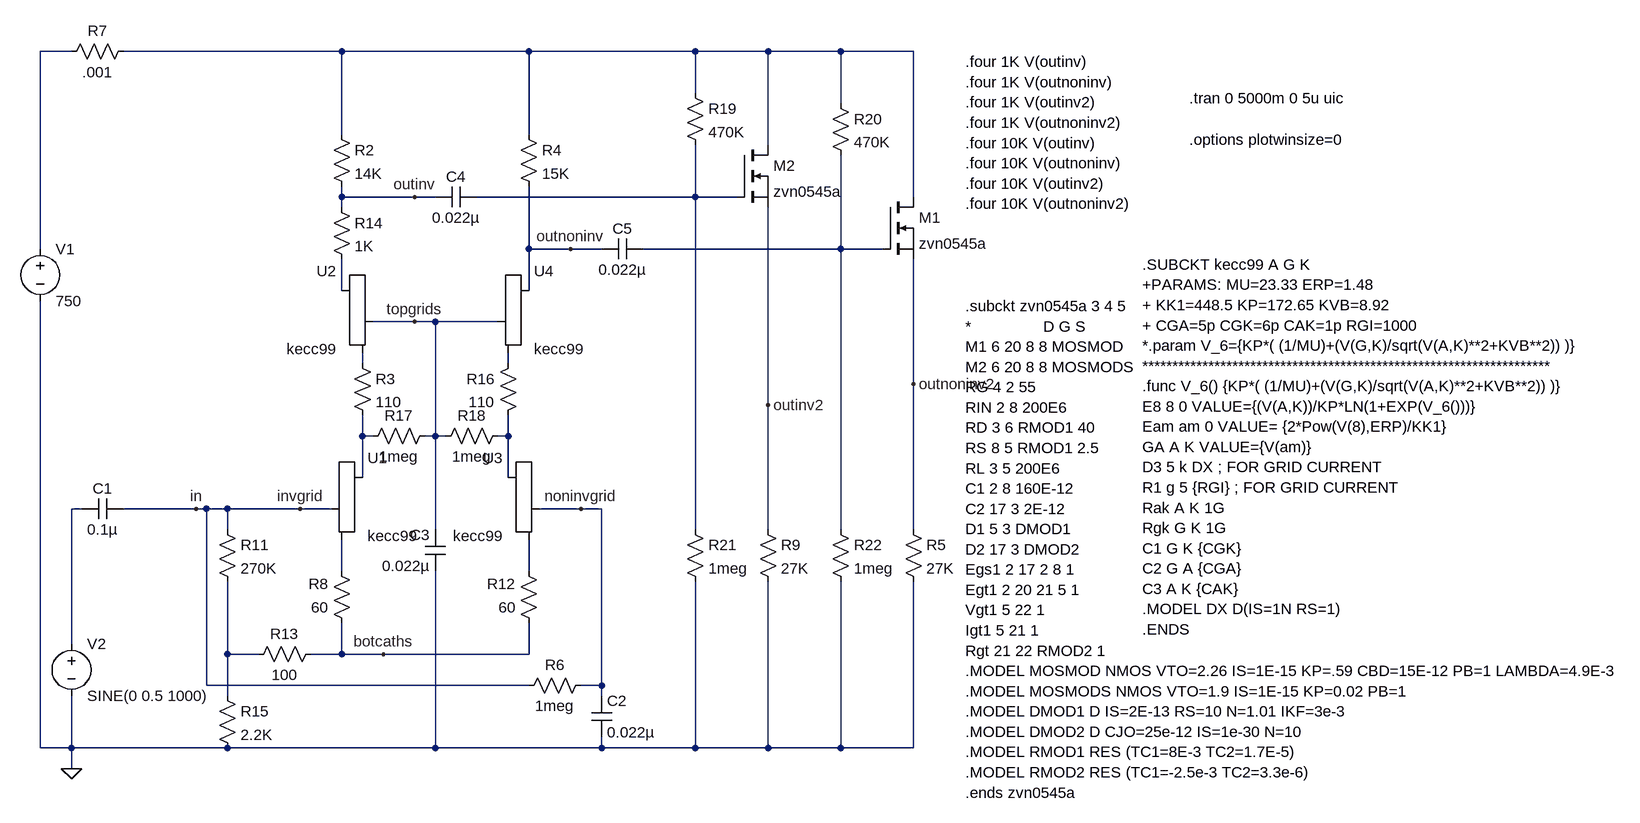
[diagram p0: schematic ltp_cascode_nmos_ecc99.asc]
ltp_cascode_nmos_ecc99.asc, the LTspice schematic file:
Version 4
SHEET 1 2892 944
WIRE -336 -448 -384 -448
WIRE 80 -448 -256 -448
WIRE 368 -448 80 -448
WIRE 624 -448 368 -448
WIRE 736 -448 624 -448
WIRE 848 -448 736 -448
WIRE 960 -448 848 -448
WIRE 624 -384 624 -448
WIRE 848 -368 848 -448
WIRE 80 -320 80 -448
WIRE 368 -320 368 -448
WIRE 736 -304 736 -448
WIRE 80 -224 80 -240
WIRE 192 -224 80 -224
WIRE 224 -224 192 -224
WIRE 624 -224 624 -304
WIRE 624 -224 288 -224
WIRE 688 -224 624 -224
WIRE 960 -224 960 -448
WIRE 80 -208 80 -224
WIRE -384 -144 -384 -448
WIRE 368 -144 368 -240
WIRE 432 -144 368 -144
WIRE 480 -144 432 -144
WIRE 848 -144 848 -288
WIRE 848 -144 544 -144
WIRE 912 -144 848 -144
WIRE 80 -80 80 -128
WIRE 368 -80 368 -144
WIRE 192 -32 128 -32
WIRE 224 -32 192 -32
WIRE 320 -32 224 -32
WIRE 112 32 112 16
WIRE 336 32 336 16
WIRE 960 64 960 -128
WIRE 736 96 736 -208
WIRE 112 144 112 112
WIRE 128 144 112 144
WIRE 224 144 224 -32
WIRE 224 144 208 144
WIRE 240 144 224 144
WIRE 336 144 336 112
WIRE 336 144 320 144
WIRE 112 208 112 144
WIRE 336 208 336 144
WIRE -320 256 -336 256
WIRE -144 256 -256 256
WIRE -128 256 -144 256
WIRE -96 256 -128 256
WIRE 16 256 -96 256
WIRE 64 256 16 256
WIRE 448 256 384 256
WIRE 480 256 448 256
WIRE -96 288 -96 256
WIRE 224 288 224 144
WIRE 624 288 624 -224
WIRE 736 288 736 96
WIRE 848 288 848 -144
WIRE 960 288 960 64
WIRE 80 352 80 304
WIRE 368 352 368 304
WIRE -336 464 -336 256
WIRE -96 480 -96 368
WIRE -48 480 -96 480
WIRE 80 480 80 432
WIRE 80 480 32 480
WIRE 144 480 80 480
WIRE 368 480 368 432
WIRE 368 480 144 480
WIRE -128 528 -128 256
WIRE 368 528 -128 528
WIRE 480 528 480 256
WIRE 480 528 448 528
WIRE -96 544 -96 480
WIRE 480 544 480 528
WIRE -384 624 -384 -64
WIRE -336 624 -336 544
WIRE -336 624 -384 624
WIRE -96 624 -336 624
WIRE 224 624 224 352
WIRE 224 624 -96 624
WIRE 480 624 480 608
WIRE 480 624 224 624
WIRE 624 624 624 368
WIRE 624 624 480 624
WIRE 736 624 736 368
WIRE 736 624 624 624
WIRE 848 624 848 368
WIRE 848 624 736 624
WIRE 960 624 960 368
WIRE 960 624 848 624
WIRE -336 656 -336 624
FLAG -336 656 0
FLAG 192 -224 outinv
FLAG -144 256 in
FLAG 432 -144 outnoninv
FLAG 960 64 outnoninv2
FLAG 736 96 outinv2
FLAG 192 -32 topgrids
FLAG 448 256 noninvgrid
FLAG 16 256 invgrid
FLAG 144 480 botcaths
SYMBOL Misc\\triode 112 256 R0
SYMATTR InstName U1
SYMATTR Value kecc99
SYMBOL voltage -384 -160 R0
WINDOW 123 0 0 Left 0
WINDOW 39 0 0 Left 0
SYMATTR InstName V1
SYMATTR Value 750
SYMBOL voltage -336 448 R0
WINDOW 123 0 0 Left 0
WINDOW 39 0 0 Left 0
SYMATTR InstName V2
SYMATTR Value SINE(0 0.5 1000)
SYMBOL cap -256 240 R90
WINDOW 0 0 32 VBottom 0
WINDOW 3 32 32 VTop 0
SYMATTR InstName C1
SYMATTR Value 0.1µ
SYMBOL res 944 272 R0
SYMATTR InstName R5
SYMATTR Value 27K
SYMBOL Misc\\triode 336 256 M0
SYMATTR InstName U3
SYMATTR Value kecc99
SYMBOL res 720 272 R0
SYMATTR InstName R9
SYMATTR Value 27K
SYMBOL nmos 912 -224 R0
SYMATTR InstName M1
SYMATTR Value zvn0545a
SYMATTR Prefix X
SYMBOL nmos 688 -304 R0
SYMATTR InstName M2
SYMATTR Value zvn0545a
SYMATTR Prefix X
SYMBOL cap 464 544 R0
SYMATTR InstName C2
SYMATTR Value 0.022µ
SYMBOL Misc\\triode 80 -32 M0
SYMATTR InstName U2
SYMATTR Value kecc99
SYMBOL Misc\\triode 368 -32 R0
SYMATTR InstName U4
SYMATTR Value kecc99
SYMBOL res 64 -336 R0
SYMATTR InstName R2
SYMATTR Value 14K
SYMBOL res 352 -336 R0
SYMATTR InstName R4
SYMATTR Value 15K
SYMBOL res -240 -464 R90
WINDOW 0 0 56 VBottom 0
WINDOW 3 32 56 VTop 0
SYMATTR InstName R7
SYMATTR Value .001
SYMBOL cap 240 288 M0
SYMATTR InstName C3
SYMATTR Value 0.022µ
SYMBOL res -112 272 R0
SYMATTR InstName R11
SYMATTR Value 270K
SYMBOL res -112 528 R0
SYMATTR InstName R15
SYMATTR Value 2.2K
SYMBOL res 96 16 R0
SYMATTR InstName R3
SYMATTR Value 110
SYMBOL res 352 16 M0
SYMATTR InstName R16
SYMATTR Value 110
SYMBOL res 224 128 R90
WINDOW 0 0 56 VBottom 0
WINDOW 3 32 56 VTop 0
SYMATTR InstName R17
SYMATTR Value 1meg
SYMBOL res 336 128 R90
WINDOW 0 0 56 VBottom 0
WINDOW 3 32 56 VTop 0
SYMATTR InstName R18
SYMATTR Value 1meg
SYMBOL res 464 512 R90
WINDOW 0 0 56 VBottom 0
WINDOW 3 32 56 VTop 0
SYMATTR InstName R6
SYMATTR Value 1meg
SYMBOL res 96 448 R180
WINDOW 0 36 76 Left 0
WINDOW 3 36 40 Left 0
SYMATTR InstName R8
SYMATTR Value 60
SYMBOL res 384 448 R180
WINDOW 0 36 76 Left 0
WINDOW 3 36 40 Left 0
SYMATTR InstName R12
SYMATTR Value 60
SYMBOL res 48 464 R90
WINDOW 0 0 56 VBottom 0
WINDOW 3 32 56 VTop 0
SYMATTR InstName R13
SYMATTR Value 100
SYMBOL res 64 -224 R0
SYMATTR InstName R14
SYMATTR Value 1K
SYMBOL cap 288 -240 R90
WINDOW 0 0 32 VBottom 0
WINDOW 3 32 32 VTop 0
SYMATTR InstName C4
SYMATTR Value 0.022µ
SYMBOL cap 544 -160 R90
WINDOW 0 0 32 VBottom 0
WINDOW 3 32 32 VTop 0
SYMATTR InstName C5
SYMATTR Value 0.022µ
SYMBOL res 608 -400 R0
SYMATTR InstName R19
SYMATTR Value 470K
SYMBOL res 832 -384 R0
SYMATTR InstName R20
SYMATTR Value 470K
SYMBOL res 608 272 R0
SYMATTR InstName R21
SYMATTR Value 1meg
SYMBOL res 832 272 R0
SYMATTR InstName R22
SYMATTR Value 1meg
TEXT 1384 -376 Left 0 !.tran 0 5000m 0 5u uic
TEXT 1384 -312 Left 0 !.options plotwinsize=0
TEXT 1040 -432 Left 0 !.four 1K V(outinv)\n.four 1K V(outnoninv)\n.four 1K V(outinv2)\n.four 1K V(outnoninv2)\n.four 10K V(outinv)\n.four 10K V(outnoninv)\n.four 10K V(outinv2)\n.four 10K V(outnoninv2)
TEXT 1040 -56 Left 0 !.subckt zvn0545a 3 4 5\n*                D G S\nM1 6 20 8 8 MOSMOD\nM2 6 20 8 8 MOSMODS\nRG 4 2 55\nRIN 2 8 200E6\nRD 3 6 RMOD1 40\nRS 8 5 RMOD1 2.5 \nRL 3 5 200E6\nC1 2 8 160E-12\nC2 17 3 2E-12 \nD1 5 3 DMOD1\nD2 17 3 DMOD2\nEgs1 2 17 2 8 1\nEgt1 2 20 21 5 1\nVgt1 5 22 1\nIgt1 5 21 1\nRgt 21 22 RMOD2 1\n.MODEL MOSMOD NMOS VTO=2.26 IS=1E-15 KP=.59 CBD=15E-12 PB=1 LAMBDA=4.9E-3\n.MODEL MOSMODS NMOS VTO=1.9 IS=1E-15 KP=0.02 PB=1\n.MODEL DMOD1 D IS=2E-13 RS=10 N=1.01 IKF=3e-3\n.MODEL DMOD2 D CJO=25e-12 IS=1e-30 N=10\n.MODEL RMOD1 RES (TC1=8E-3 TC2=1.7E-5)\n.MODEL RMOD2 RES (TC1=-2.5e-3 TC2=3.3e-6)\n.ends zvn0545a
TEXT 1312 -120 Left 0 !.SUBCKT kecc99 A G K \n+PARAMS: MU=23.33 ERP=1.48\n+ KK1=448.5 KP=172.65 KVB=8.92\n+ CGA=5p CGK=6p CAK=1p RGI=1000\n*.param V_6={KP*( (1/MU)+(V(G,K)/sqrt(V(A,K)**2+KVB**2)) )} \n********************************************************************\n.func V_6() {KP*( (1/MU)+(V(G,K)/sqrt(V(A,K)**2+KVB**2)) )} \nE8 8 0 VALUE={(V(A,K))/KP*LN(1+EXP(V_6()))}\nEam am 0 VALUE= {2*Pow(V(8),ERP)/KK1}\nGA A K VALUE={V(am)}\nD3 5 k DX ; FOR GRID CURRENT\nR1 g 5 {RGI} ; FOR GRID CURRENT\nRak A K 1G\nRgk G K 1G\nC1 G K {CGK}\nC2 G A {CGA}\nC3 A K {CAK}\n.MODEL DX D(IS=1N RS=1)\n.ENDS

The netlist it stands for:
* ltp_cascode_nmos_ecc99.asc
XU1 N008 invgrid N011 kecc99
V1 N001 0 750
V2 N010 0 SINE(0 0.5 1000)
C1 invgrid N010 0.1µ
R5 outnoninv2 0 27K
XU3 N009 noninvgrid N012 kecc99
R9 outinv2 0 27K
XM1 N002 N004 outnoninv2 zvn0545a  ; pins D G S
XM2 N002 N003 outinv2 zvn0545a  ; pins D G S
C2 noninvgrid 0 0.022µ
XU2 N005 topgrids N006 kecc99
XU4 outnoninv topgrids N007 kecc99
R2 N002 outinv 14K
R4 N002 outnoninv 15K
R7 N002 N001 .001
C3 topgrids 0 0.022µ
R11 invgrid N013 270K
R15 N013 0 2.2K
R3 N006 N008 110
R16 N007 N009 110
R17 topgrids N008 1meg
R18 N009 topgrids 1meg
R6 noninvgrid invgrid 1meg
R8 botcaths N011 60
R12 botcaths N012 60
R13 botcaths N013 100
R14 outinv N005 1K
C4 N003 outinv 0.022µ
C5 N004 outnoninv 0.022µ
R19 N002 N003 470K
R20 N002 N004 470K
R21 N003 0 1meg
R22 N004 0 1meg
.tran 0 5000m 0 5u uic
.options plotwinsize=0
.four 1K V(outinv)
.four 1K V(outnoninv)
.four 1K V(outinv2)
.four 1K V(outnoninv2)
.four 10K V(outinv)
.four 10K V(outnoninv)
.four 10K V(outinv2)
.four 10K V(outnoninv2)
.subckt zvn0545a 3 4 5
*                D G S
M1 6 20 8 8 MOSMOD
M2 6 20 8 8 MOSMODS
RG 4 2 55
RIN 2 8 200E6
RD 3 6 RMOD1 40
RS 8 5 RMOD1 2.5
RL 3 5 200E6
C1 2 8 160E-12
C2 17 3 2E-12
D1 5 3 DMOD1
D2 17 3 DMOD2
Egs1 2 17 2 8 1
Egt1 2 20 21 5 1
Vgt1 5 22 1
Igt1 5 21 1
Rgt 21 22 RMOD2 1
.MODEL MOSMOD NMOS VTO=2.26 IS=1E-15 KP=.59 CBD=15E-12 PB=1 LAMBDA=4.9E-3
.MODEL MOSMODS NMOS VTO=1.9 IS=1E-15 KP=0.02 PB=1
.MODEL DMOD1 D IS=2E-13 RS=10 N=1.01 IKF=3e-3
.MODEL DMOD2 D CJO=25e-12 IS=1e-30 N=10
.MODEL RMOD1 RES (TC1=8E-3 TC2=1.7E-5)
.MODEL RMOD2 RES (TC1=-2.5e-3 TC2=3.3e-6)
.ends zvn0545a
.SUBCKT kecc99 A G K
+PARAMS: MU=23.33 ERP=1.48
+ KK1=448.5 KP=172.65 KVB=8.92
+ CGA=5p CGK=6p CAK=1p RGI=1000
*.param V_6={KP*( (1/MU)+(V(G,K)/sqrt(V(A,K)**2+KVB**2)) )}
********************************************************************
.func V_6() {KP*( (1/MU)+(V(G,K)/sqrt(V(A,K)**2+KVB**2)) )}
E8 8 0 VALUE={(V(A,K))/KP*LN(1+EXP(V_6()))}
Eam am 0 VALUE= {2*Pow(V(8),ERP)/KK1}
GA A K VALUE={V(am)}
D3 5 k DX ; FOR GRID CURRENT
R1 g 5 {RGI} ; FOR GRID CURRENT
Rak A K 1G
Rgk G K 1G
C1 G K {CGK}
C2 G A {CGA}
C3 A K {CAK}
.MODEL DX D(IS=1N RS=1)
.ENDS
.backanno
.end